# Altium schematic sheet Mezclador2.SchDoc
size A4
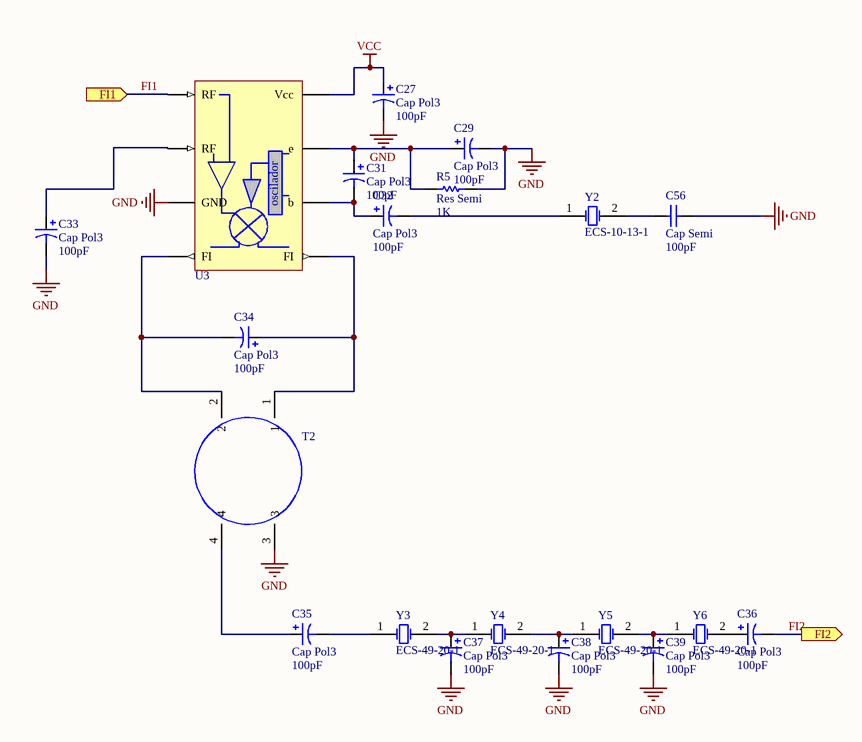
[diagram p0: Mezclador2.SchDoc]

## Parts
C27  Cap Pol3  value 100pF  [C0805]
C29  Cap Pol3  value 100pF  [C0805]
C31  Cap Pol3  value 100pF  [C0805]
C32  Cap Pol3  value 100pF  [C0805]
C33  Cap Pol3  value 100pF  [C0805]
C34  Cap Pol3  value 100pF  [C0805]
C35  Cap Pol3  value 100pF  [C0805]
C36  Cap Pol3  value 100pF  [C0805]
C37  Cap Pol3  value 100pF  [C0805]
C38  Cap Pol3  value 100pF  [C0805]
C39  Cap Pol3  value 100pF  [C0805]
C56  Cap Semi  value 100pF  [C1206]
R5  Res Semi  value 1K  [2012[0805]]
T2  Toroide  [NTH12_4]  (value not drawn)
U3  SA602  [SA602]  (value not drawn)
Y2  ECS-10-13-1  [HC-49U]
Y3  ECS-49-20-1  [HC-49U]
Y4  ECS-49-20-1  [HC-49U]
Y5  ECS-49-20-1  [HC-49U]
Y6  ECS-49-20-1  [HC-49U]

## Ports
FI1 (in), FI2 (out)

## Nets
GND: C27.2 C29.2 C33.2 C37.2 C38.2 C39.2 C56.2 R5.1 T2.3 U3.3(GND)
VCC: C27.1 U3.8(Vcc)
FI1: U3.1(RF) ; port FI1
FI2: C36.2 ; port FI2
NetC29_1: C29.1 C31.1 R5.2 U3.7(e)
NetC31_2: C31.2 C32.1 U3.6(b)
NetC32_2: C32.2 Y2.1(OSC1)
NetC33_1: C33.1 U3.2(RF)
NetC34_1: C34.1 T2.1 U3.5(FI)
NetC34_2: C34.2 T2.2 U3.4(FI)
NetC35_1: C35.1 T2.4
NetC35_2: C35.2 Y3.1(OSC1)
NetC36_1: C36.1 Y6.2(OSC2)
NetC37_1: C37.1 Y3.2(OSC2) Y4.1(OSC1)
NetC38_1: C38.1 Y4.2(OSC2) Y5.1(OSC1)
NetC39_1: C39.1 Y5.2(OSC2) Y6.1(OSC1)
NetC56_1: C56.1 Y2.2(OSC2)

## Notes on the sheet
- (in symbol SA602A) oscilador

## Library data of the parts
C27 C29 C31-C39 = Cap Pol3: Polarized Capacitor (Surface Mount); Published: 8-Jun-2000; LatestRevisionDate: 17-Jul-2002; LatestRevisionNote: Re-released for DXP Platform.; PackageReference: C0805; Publisher: Altium Limited
C56 = Cap Semi: Capacitor (Semiconductor SIM Model); Published: 8-Jun-2000; LatestRevisionDate: 17-Jul-2002; LatestRevisionNote: Re-released for DXP Platform.; PackageReference: C1206; Publisher: Altium Limited
R5 = Res Semi: Semiconductor Resistor; Published: 8-Jun-2000; LatestRevisionDate: 17-Jul-2002; LatestRevisionNote: Re-released for DXP Platform.; PackageReference: AXIAL-0.5; Publisher: Altium Limited
T2 = Transformador_Toroide
U3 = SA602A: Mezclador 500MHz
Y2 = ECS-10-13-1: Crystal Oscillator; Published: 17-Jul-2002; DatasheetDocument: 18-Apr-2000; PackageReference: HC-49U; Publisher: Altium Limited; ComponentLink1Description: Manufacturer Link; ComponentLink1URL: http://www.ecsxtal.com/; ComponentLink2Description: Datasheet; ComponentLink2URL: http://www.ecsxtal.com/pdf2/HC49U.PDF
Y3-Y6 = ECS-49-20-1: Crystal Oscillator; Published: 17-Jul-2002; DatasheetDocument: 18-Apr-2000; PackageReference: HC-49U; Publisher: Altium Limited; ComponentLink1Description: Manufacturer Link; ComponentLink1URL: http://www.ecsxtal.com/; ComponentLink2Description: Datasheet; ComponentLink2URL: http://www.ecsxtal.com/pdf2/HC49U.PDF